# EAGLE design LedKeychain (EAGLE 7.5.0)
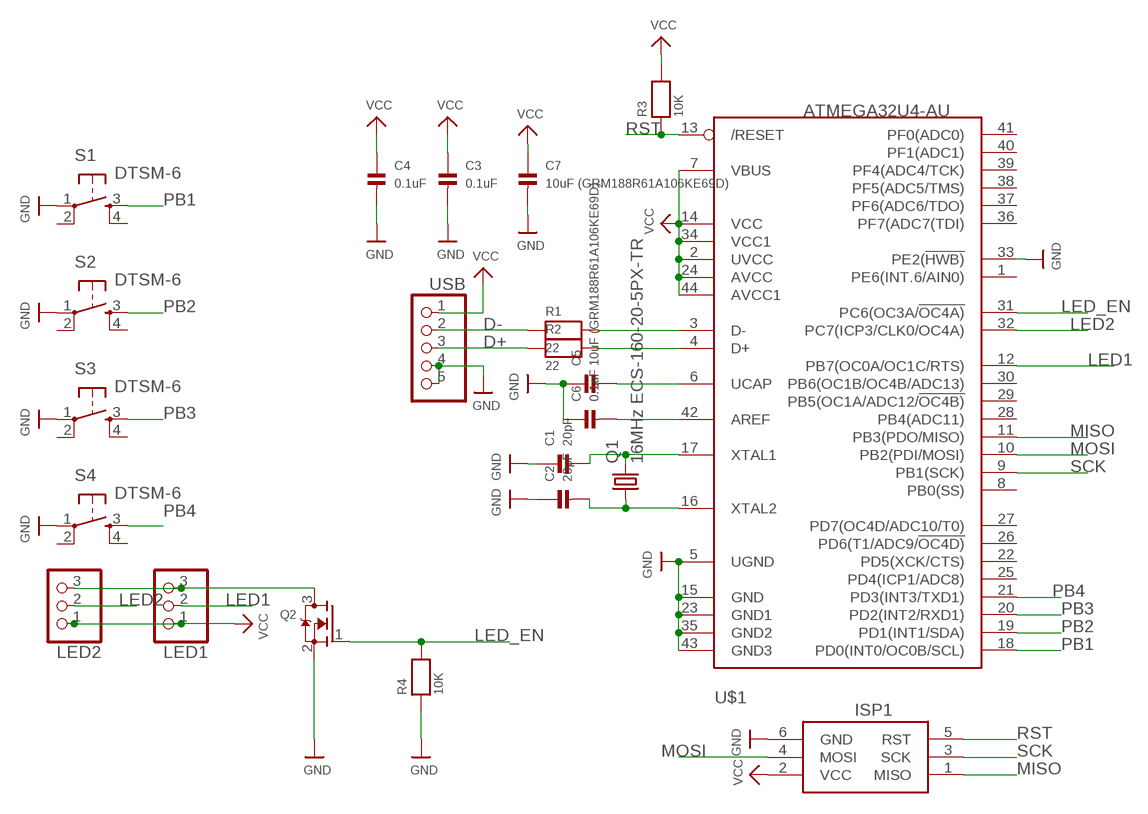
[diagram p0: schematic, sheet 1]

## Parts
C1  20pF  CAP_CERAMIC0603MINI  [0603-MINI]
C2  20pF  CAP_CERAMIC0603MINI  [0603-MINI]
C3  0.1uF  CAP_CERAMIC0603MINI  [0603-MINI]
C4  0.1uF  CAP_CERAMIC0603MINI  [0603-MINI]
C5  10uF (GRM188R61A106KE69D)  CAP_CERAMIC0603MINI  [0603-MINI]
C6  0.1uF  CAP_CERAMIC0603MINI  [0603-MINI]
C7  10uF (GRM188R61A106KE69D)  CAP_CERAMIC0603MINI  [0603-MINI]
ISP1  AVRISP-6  [AVRISP]
LED1  PINHD-1X3  [1X03]
LED2  PINHD-1X3  [1X03]
Q1  16MHz ECS-160-20-5PX-TR  CRYSTALHC49UP  [HC49UP]
Q2  MOSFET-NWIDE  [SOT23-WIDE]
R1  22  RESISTOR0603MINI  [0603-MINI]
R2  22  RESISTOR0603MINI  [0603-MINI]
R3  10K  RESISTOR0603MINI  [0603-MINI]
R4  10K  RESISTOR0603MINI  [0603-MINI]
S1  DTSM-6  [DTSM-6]
S2  DTSM-6  [DTSM-6]
S3  DTSM-6  [DTSM-6]
S4  DTSM-6  [DTSM-6]
U$1  ATMEGA32U4-AU  [TQFP44]
USB  PINHD-1X5/90  [1X05/90]

## Nets
D+: R2.1 USB.3
D-: R1.1 USB.2
GND: C1.1 C2.1 C3.2 C4.2 C5.1 C6.1 C7.2 ISP1.6(GND) Q2.2(S) R4.1 S1.1 S2.1 S3.1 S4.1 U$1.5(UGND) U$1.15(GND) U$1.23(GND1) U$1.33(PE2(!HWB)) U$1.35(GND2) U$1.43(GND3) USB.4 USB.5
LED1: LED1.2 U$1.12(PB7(OC0A/OC1C/RTS))
LED2: LED2.2 U$1.32(PC7(ICP3/CLK0/OC4A))
LED_EN: Q2.1(G) R4.2 U$1.31(PC6(OC3A/!OC4A))
MISO: ISP1.1(MISO) U$1.11(PB3(PDO/MISO))
MOSI: ISP1.4(MOSI) U$1.10(PB2(PDI/MOSI))
N$1: C2.2 Q1.1 U$1.16(XTAL2)
N$2: C1.2 Q1.2 U$1.17(XTAL1)
N$3: R1.2 U$1.3(D-)
N$4: R2.2 U$1.4(D+)
N$5: C5.2 U$1.6(UCAP)
N$6: C6.2 U$1.42(AREF)
N$7: LED1.3 LED2.3 Q2.3(D)
PB1: S1.3 U$1.18(PD0(INT0/OC0B/SCL))
PB2: S2.3 U$1.19(PD1(INT1/SDA))
PB3: S3.3 U$1.20(PD2(INT2/RXD1))
PB4: S4.3 U$1.21(PD3(INT3/TXD1))
RST: ISP1.5(RST) R3.1 U$1.13(/RESET)
SCK: ISP1.3(SCK) U$1.9(PB1(SCK))
VCC: C3.1 C4.1 C7.1 ISP1.2(VCC) LED1.1 LED2.1 R3.2 U$1.2(UVCC) U$1.7(VBUS) U$1.14(VCC) U$1.24(AVCC) U$1.34(VCC1) U$1.44(AVCC1) USB.1
Unconnected: S1.2 S1.4 S2.2 S2.4 S3.2 S3.4 S4.2 S4.4 U$1.1(PE6(INT.6/AIN0)) U$1.8(PB0(SS)) U$1.22(PD5(XCK/CTS)) U$1.25(PD4(ICP1/ADC8)) U$1.26(PD6(T1/ADC9/!OC4D)) U$1.27(PD7(OC4D/ADC10/T0)) U$1.28(PB4(ADC11)) U$1.29(PB5(OC1A/ADC12/!OC4B)) U$1.30(PB6(OC1B/OC4B/ADC13)) U$1.36(PF7(ADC7(TDI)) U$1.37(PF6(ADC6/TDO)) U$1.38(PF5(ADC5/TMS)) U$1.39(PF4(ADC4/TCK)) U$1.40(PF1(ADC1)) U$1.41(PF0(ADC0))

## Library data of the parts
C1-C7 = microbuilder:CAP_CERAMIC: Ceramic Capacitors 0402 - 0402 Surface Mount Capacitors 16pF 50V 5% [Digikey: 445-4899-2-ND] 18pF 50V 5% [Digikey: 490-1281-2-ND] 22pF 50V 5% [Digikey: 490-1283-2-ND] 68pF 50V 5% [Digikey: 490-1289-2-ND] 0.1uF 10V 10% [Digikey: 490-1318-2-ND] 1.0uF 6.3V 10% [Digikey: 490-1320-2-ND] 0603 - 0603 Surface Mount Capacitors 16 pF 50V 5% [Digikey: 445-5051-2-ND] 22 pF 50V [Digikey: PCC220ACVTR-ND] 33 pF 50V 5% [Digikey: 490-1415-1-ND] 56pF 50V 5% [Digikey: 490-1421-1-ND] 220pF 50V 5% [Digikey: 445-1285-1-ND] 680 pF 50V 2200 pF 50V 5% C0G [Digikey: 445-1297-1-ND] 5600 pF 100V 5% X7R [Digikey: 478-3711-1-ND] 0.1 µF 25V 10% [Digikey: PCC2277TR-ND] 0.22 µF 16V 10% X7R [Digikey: 445-1318-1-ND] 1.0 µF 25V 10% [Digikey: 445-5146-2-ND] 0603 - RF Specific 3pF 250V +/-0.1pF RF [Digikey: 712-1347-1-ND] 18 pF 250V 5% [Digikey: 478-3505-1-ND or 712-1322-1-ND] 56 pF 250V 5% C0G RF [Digikey: 490-4867-1-ND] 68 pF 250V RF [Digikey: 490-4868-1-ND] 0805 - 0805 Surface Mount Capacitors 220 pF 250V 2% RF Ceramic Capacitor [Digikey: 712-1398-1-ND] 1000 pF 50V 2% NP0 Ceramic Capacitor [Digikey: 478-3760-1-ND] 0.1 µF 25V 10% Ceramic Capacitor [Digikey: PCC1828TR-ND] 1.0 µF 16V 10% Ceramic Capacitor[Digikey: 490-1691-2-ND] 10.0 µF 10V 10% Ceramic Capacitor[Digikey: 709-1228-1-ND] 10.0 uF 16V 10% Ceramic Capacitor [Digikey: 478-5165-2-ND] 47 uF 6.3V 20% Ceramic Capacitor [Digikey: 587-1779-1-ND or 399-5506-1-ND] 1206 - 1206 Surface Mount Capacitors 47uF 10V 20% Ceramic Capacitor [Digikey: 490-5528-1-ND or 399-5508-1-ND or 445-6010-1-ND] 100uF 6.3V -20%, +80% Y5V Ceramic Capacitor (Digikey: 490-4512-1-ND, Mouser: 81-GRM31CF50J107ZE1L)
ISP1 = adafruit:AVRISP: AVR ISP HEADER Standard 6 pin header for AVR programming
LED1 LED2 = adafruit:PINHD-1X3: PIN HEADER
Q1 = adafruit:CRYSTAL: CRYSTAL; OC_FARNELL: unknown; OC_NEWARK: unknown
Q2 = microbuilder:MOSFET-N: N-Channel Mosfet LEGEND VDS: Voltage Drain-Source ID: Drain Current RDS(ON): Drain-Source On-State Resistance VGS(TH): Gate-Source Threshold Voltage CISS: Drain-Source Input Capacitance SOT-23 Name VDS ID RDS(ON) VGS(TH) CISS Order Number 2N7002E 60V 260mA 2.5 Ohm 2.5V @ 250uA 26.7pF @ 25V 2N7002ET1GOSTR-ND BSH103 30V 850mA 400 mOhm 400mV @ 1mA 83pF @ 24V BSH103,235-ND BSS138 60V 320mA 1.6 Ohm 1.5V @ 250uA 50pF @ 10V Mouser: 771-BSS138PW115 DMN2075U-7 20V 4.2A 38 mOhm 1V @ 250 uA 594.3pF @ 10V DMN2075U-7DICT-ND * BSS138 good choice for I2C level-shifting
R1-R4 = microbuilder:RESISTOR: Resistors 0402 - 0402 Surface Mount Package 22 Ohm 1% 1/16W [Digikey: 311-22.0LRTR-ND] 33 Ohm 5% 1/16W 1.0K 5% 1/16W 1.5K 5% 1/16W 2.0K 1% 1/16W 10.0K 1% 1/16W [Digikey: 311-10.0KLRTR-ND] 10.0K 5% 1/16W [Digikey: RMCF0402JT10K0TR-ND] 12.1K 1% 1/16W [Digikey: 311-22.0LRTR-ND] 100.0K 5% 1/16W 0603 - 0603 Surface Mount Package 0 Ohm 1/10 Watt 1% Resistor 15 Ohm 1/10 Watt 1% Resistor 33 Ohm 1/10 Watt 1% Resistor 49.9 Ohm 1/10 Watt 1% Resistor 100 Ohm 1/10 Watt 1% Resistor 150 Ohm 1/10 Watt 1% Resistor 240 Ohm 1/10 Watt 1% Resistor 390 Ohm 1/10 Watt 1% Resistor 560 Ohm 1/10 Watt 1% Resistor 680 Ohm 1/10 Watt 1% Resistor 750 Ohm 1/10 Watt 1% Resistor 1.0K Ohm 1/10 Watt 1% Resistor 1.5K Ohm 1/10 Watt 1% Resistor 2.0K Ohm 1/10 Watt 1% Resistor 2.2K Ohm 1/10 Watt 1% Resistor 3.3K Ohm 1/10 Watt 1% Resistor 4.7K Ohm 1/10 Watt 1% Resistor 10.0K Ohm 1/10 Watt 1% Resistor 12.0K Ohm 1/10 Watt 1% Resistor 12.1K Ohm 1/10 Watt 1% Resistor 20.0K Ohm 1/10 Watt 1% Resistor 33.0K Ohm 1/10 Watt 1% Resistor 100.0K Ohm 1/10 Watt 1% Resistor 0805 - 0805 Surface Mount Package 0 Ohm 1/8 Watt 1% Resistor 33 Ohm 1/8 Watt 1% Resistor 100 Ohm 1/8 Watt 1% Resistor 150 Ohm 1/8 Watt 1% Resistor 200 Ohm 1/8 Watt 1% Resistor 240 Ohm 1/8 Watt 1% Resistor 330 Ohm 1/8 Watt 1% Resistor 390 Ohm 1/8 Watt 1% Resistor 470 Ohm 1/8 Watt 1% Resistor 1.0K Ohm 1/8 Watt 1% Resistor 1.5K Ohm 1/8 Watt 1% Resistor 2.0K Ohm 1/8 Watt 1% Resistor 4.7K Ohm 1/8 Watt 1% Resistor 5.1K Ohm 1/8 Watt 1% Resistor 5.6K Ohm 1/8 Watt 1% Resistor 10.0K Ohm 1/8 Watt 1% Resistor 22.0K Ohm 1/8 Watt 1% Resistor 33.0K Ohm 1/8 Watt 1% Resistor 100K Ohm 1/8 Watt 1% Resistor 1206 - 1206 Surface Mount Package 2012 - 2010 Surface Mount Package 0.11 Ohm 1/2 Watt 1% Resistor - Digikey: RHM.11UCT-ND
S1-S4 = switch-tact:DTSM-6
U$1 = adafruit:ATMEGA32U4: http://www.ladyada.net/library/eagle
USB = pinhead:PINHD-1X5: PIN HEADER

## Board
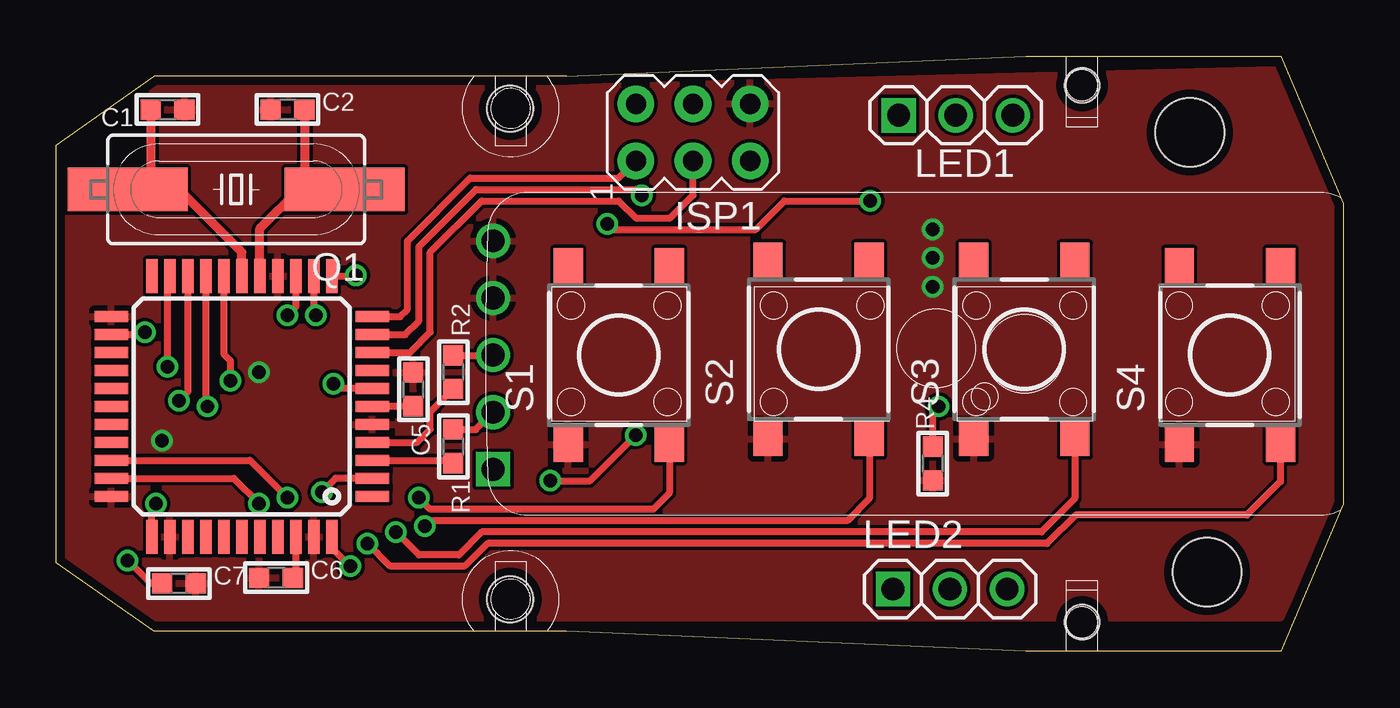
[diagram p1: board, top side]
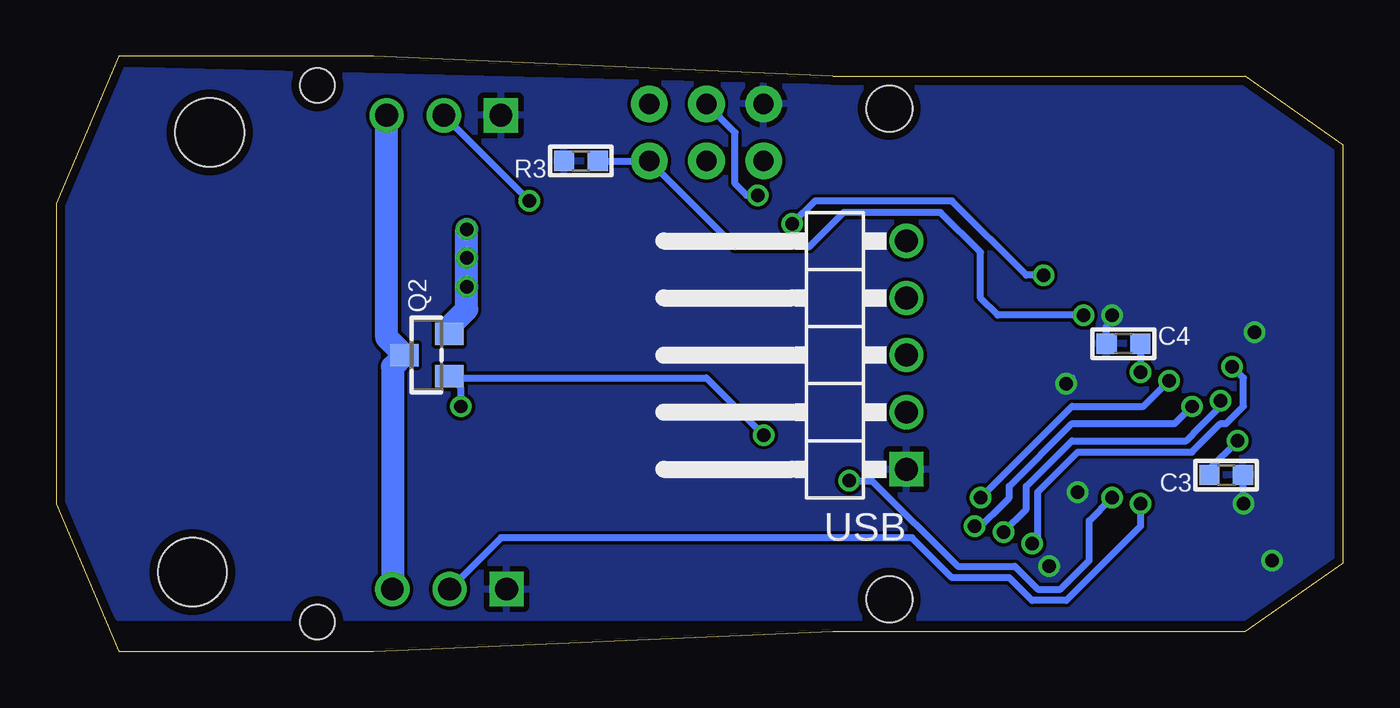
[diagram p2: board, bottom side, seen from below]

Size 57.24 x 26.48 mm. Coordinates in mm from the lower left corner, seen from the top.
Outline: 46.33,26.48 54.46,26.48 57.24,19.93 57.24,6.55 54.46,0 46.33,0
Outline: 44.91,0 43.13,0 22.7,0.9 4.35,0.9 0,3.95 0,22.53 4.35,25.58
Outline: 22.7,25.58 43.13,26.48 44.91,26.48
Outline: 46.32,0 44.92,0
Outline: 44.92,26.48 46.32,26.48
Outline: 22.7,25.59 4.35,25.59
Copper layers (1*16): Top 0.0356mm / dielectric 1.5011mm / Bottom 0.0356mm
Design rules "oshpark *": minimum track width 6mil, minimum drill 13mil, track to track 6mil, track to pad 6mil, pad to pad 6mil, via to via 6mil, smd to smd 6mil, copper to edge 15mil, drill to drill 6mil, minimum pad ring 7mil, minimum via ring 7mil, stop-mask expansion 3mil, vias tented up to drill 0mil, thermal gap 10mil
Holes 2.03 mm at 20.19,24.15 20.19,2.31
Holes 1.52 mm at 45.62,1.29 45.62,25.17
Holes 3.05 mm at 50.42,23.09 51.18,3.53

### Footprints (pad centres in the part's own frame; a part is rotated, then mirrored left to right if it is on the bottom)
0603-MINI = smd 0.9 x 0.9: 1 -0.75,0; 2 0.75,0
AVRISP = drill 0.9 pad 1.626: 1 -1.27,2.54; 2 1.27,2.54; 3 -1.27,0; 4 1.27,0; 5 -1.27,-2.54; 6 1.27,-2.54
1X03 = drill 1.016 square: 1 -2.54,0 | drill 1.016: 2 0,0; 3 2.54,0
HC49UP = smd 5.334 x 1.93: 1 -4.826,0; 2 4.826,0
SOT23-WIDE = smd 1 x 1.27: 1 -0.95,-1; 2 0.95,-1; 3 0,1
DTSM-6 = smd 1.55 x 1.3: 1 -3.975,2.25; 2 3.975,2.25; 3 -3.975,-2.25; 4 3.975,-2.25
TQFP44 = smd 1.5 x 0.5: 1 -5.8,4; 2 -5.8,3.2; 3 -5.8,2.4; 4 -5.8,1.6; 5 -5.8,0.8; 6 -5.8,0; 7 -5.8,-0.8; 8 -5.8,-1.6; 9 -5.8,-2.4; 10 -5.8,-3.2; 11 -5.8,-4; 23 5.8,-4; 24 5.8,-3.2; 25 5.8,-2.4; 26 5.8,-1.6; 27 5.8,-0.8; 28 5.8,0; 29 5.8,0.8; 30 5.8,1.6; 31 5.8,2.4; 32 5.8,3.2; 33 5.8,4 | smd 0.5 x 1.5: 12 -4,-5.8; 13 -3.2,-5.8; 14 -2.4,-5.8; 15 -1.6,-5.8; 16 -0.8,-5.8; 17 0,-5.8; 18 0.8,-5.8; 19 1.6,-5.8; 20 2.4,-5.8; 21 3.2,-5.8; 22 4,-5.8; 34 4,5.8; 35 3.2,5.8; 36 2.4,5.8; 37 1.6,5.8; 38 0.8,5.8; 39 0,5.8; 40 -0.8,5.8; 41 -1.6,5.8; 42 -2.4,5.8; 43 -3.2,5.8; 44 -4,5.8
1X05/90 = drill 1.016 square: 1 -5.08,-3.81 | drill 1.016: 2 -2.54,-3.81; 3 0,-3.81; 4 2.54,-3.81; 5 5.08,-3.81

### Placement (x,y rotation side)
C1  4.95,24.1 180 top
C2  10.29,24.1 0 top
C3  5.21,7.85 180 bottom
C4  9.78,13.69 0 bottom
C5  15.88,11.66 270 top
C6  9.78,3.28 0 top
C7  5.46,3.02 0 top
ISP1  28.32,23.09 90 top
LED1  40.01,23.85 0 top
LED2  39.75,2.77 0 top
Q1  8,20.55 180 top
Q2  40.77,13.18 90 bottom
R1  17.65,9.12 270 top
R2  17.65,12.42 270 top
R3  33.91,21.82 180 bottom
R4  38.99,8.36 90 top
S1  25.02,13.18 90 top
S2  33.91,13.44 90 top
S3  43.05,13.44 90 top
S4  52.2,13.18 90 top
U$1  8.26,10.9 180 top
USB  23.24,13.18 90 bottom

### Tracks (layer width: path | path; a pad name or v marks a point on that pad's centre or on a via)
D+
  Top 0.305: R2.1 19.42,13.17 USB.3
D-
  Top 0.305: R1.1 18.66,9.87 USB.2
GND  (via drill 0.6)
  Top 0.305: v9.02,12.42 9.02,12.17 | v4.7,9.37 4.45,9.37
  Bottom 0.305: C4.2 9.03,12.43 v9.02,12.42 | C3.2 5.96,8.11 v4.7,9.37
  Bottom 1.016: Q2.2 39.77,14.44 38.99,15.21 v38.99,16.23 v38.99,17.5 v38.99,18.77
  pour Top: 0.38,22.33 0.38,4.29 4.19,1.5 54.48,1.5 56.77,6.58 56.77,19.79 54.23,25.88 24,25.12 4.45,25.12
LED1  (via drill 0.6)
  Top 0.305: U$1.12 13.29,16.7 v13.34,16.74 | v36.2,20.04 32.39,20.04 31.12,18.77 24.77,18.77 v24.51,19.02
  Bottom 0.305: v13.34,16.74 14.1,16.74 17.4,20.04 23.5,20.04 v24.51,19.02 | v36.2,20.04 LED1.2
LED2  (via drill 0.6)
  Top 0.305: U$1.32 7.9,7.7 v9.02,6.58
  Bottom 0.305: v9.02,6.58 9.02,5.56 12.32,2.26 13.84,2.26 14.86,3.28 17.4,3.28 19.18,5.05 37.47,5.05 LED2.2
LED_EN  (via drill 0.6)
  Top 0.305: R4.2 38.99,10.64 v39.24,10.9 | U$1.31 8.62,8.5 v10.29,6.83 | v21.97,7.59 23.75,7.59 v25.78,9.63
  Bottom 0.305: v39.24,10.9 39.24,11.71 39.7,12.17 | 39.7,12.17 Q2.1 | v10.29,6.83 11.3,5.82 11.3,4.04 12.57,2.77 13.59,2.77 14.61,3.78 17.15,3.78 20.96,7.59 v21.97,7.59 | v25.78,9.63 28.32,12.17 39.7,12.17
MISO
  Top 0.305: U$1.11 15.3,14.9 15.62,15.21 15.62,18.26 18.42,21.06 25.02,21.06 ISP1.1
MOSI  (via drill 0.6)
  Top 0.305: U$1.10 15.52,14.1 16.13,14.71 16.13,18.01 18.67,20.55 25.78,20.55 v26.04,20.29
  Bottom 0.305: v26.04,20.29 26.54,20.29 27.05,20.8 27.05,23.09 ISP1.4
N$1
  Top 0.406: U$1.16 9.06,18.81 10.8,20.55 11.3,20.55 | 11.3,20.55 Q1.1 | C2.2 11.04,20.81 11.3,20.55
N$2
  Top 0.406: U$1.17 8.26,17.75 5.46,20.55 4.45,20.55 | 4.45,20.55 Q1.2 | C1.2 4.2,20.79 4.45,20.55
N$3
  Top 0.305: U$1.3 17.53,8.5 R1.2
N$4
  Top 0.305: U$1.4 16.05,9.3 16.64,9.88 16.64,10.65 R2.2
N$5
  Top 0.305: C5.2 15.88,10.9 U$1.6
N$6
  Top 0.305: U$1.42 10.66,3.4 C6.2
N$7
  Bottom 1.016: LED1.3 42.55,13.96 Q2.3 42.29,12.66 LED2.3
PB1  (via drill 0.6)
  Top 0.305: S1.3 27.27,7.05 26.54,6.32 16.64,6.32 v16.13,6.83 | v7.75,12.04 7.75,12.93 7.46,13.22 U$1.18
  Bottom 0.305: v16.13,6.83 12.07,10.9 8.89,10.9 v7.75,12.04
PB2  (via drill 0.6)
  Top 0.305: S2.3 36.16,6.8 35.18,5.82 16.64,5.82 v16.38,5.56 | U$1.19 6.66,10.97 v6.73,10.9
  Bottom 0.305: v16.38,5.56 16.38,5.31 14.86,6.83 14.86,7.34 12.07,10.13 7.49,10.13 v6.73,10.9
PB3  (via drill 0.6)
  Top 0.305: S3.3 45.3,6.8 43.82,5.31 18.92,5.31 17.91,4.29 16.13,4.29 v15.11,5.31 | U$1.20 5.86,11.54 v5.46,11.15
  Bottom 0.305: v15.11,5.31 14.1,6.32 14.1,7.34 12.07,9.37 6.99,9.37 6.35,10.01 5.97,10.39 5.46,10.9 v5.46,11.15
PB4  (via drill 0.6)
  Top 0.305: S4.3 54.45,7.56 52.96,6.07 45.34,6.07 44.07,4.8 19.18,4.8 18.16,3.78 14.86,3.78 v13.84,4.8 | v4.95,12.67 4.95,16.59 U$1.21
  Bottom 0.305: v13.84,4.8 13.59,5.05 13.59,7.09 11.81,8.86 6.73,8.86 5.46,10.13 5.21,10.13 4.45,10.9 4.45,12.17 v4.95,12.67
RST  (via drill 0.6)
  Top 0.305: U$1.13 11.46,15.06 v11.56,14.96
  Bottom 0.305: v11.56,14.96 15.37,14.96 16.13,15.72 16.13,17.75 17.91,19.53 22.23,19.53 23.75,18.01 27.05,18.01 ISP1.5 R3.1
SCK
  Top 0.305: U$1.9 15.74,13.3 16.64,14.2 16.64,17.75 18.92,20.04 25.02,20.04 25.78,19.28 27.31,19.28 28.32,20.29 ISP1.3
VCC  (via drill 0.6)
  Top 0.305: U$1.14 10.66,15.33 v10.29,14.96 | U$1.34 4.26,6.39 v4.45,6.58 | U$1.7 12.54,11.7 v12.32,11.91 | U$1.24 3.84,14.1 v3.94,14.2 | U$1.44 12.26,4.61 v13.08,3.78 | C7.1 4.19,3.02 v3.18,4.04 | U$1.2 12.42,7.7 v11.81,7.09
  Bottom 0.305: C4.1 10.54,13.7 10.54,14.45 10.29,14.71 | v4.45,6.58 4.45,7.84 C3.1 | v12.32,11.91 12.07,12.17 | v3.94,14.2 4.19,14.45 | v11.81,7.09 11.56,7.09 | v3.18,4.04 2.92,4.29
  pour Bottom: 0.38,22.33 0.38,4.29 4.19,1.5 54.48,1.5 56.77,6.58 56.77,19.79 54.23,25.88 24,25.12 4.45,25.12